# Altium schematic sheet 2V5_DIST.SchDoc: 2.5V distribution
size Letter; Organization: University of California; Address1: 475 Portola Plaza; Address2: Los Angeles, CA 90095; Revision: R01; SheetNumber: 1; SheetTotal: 1
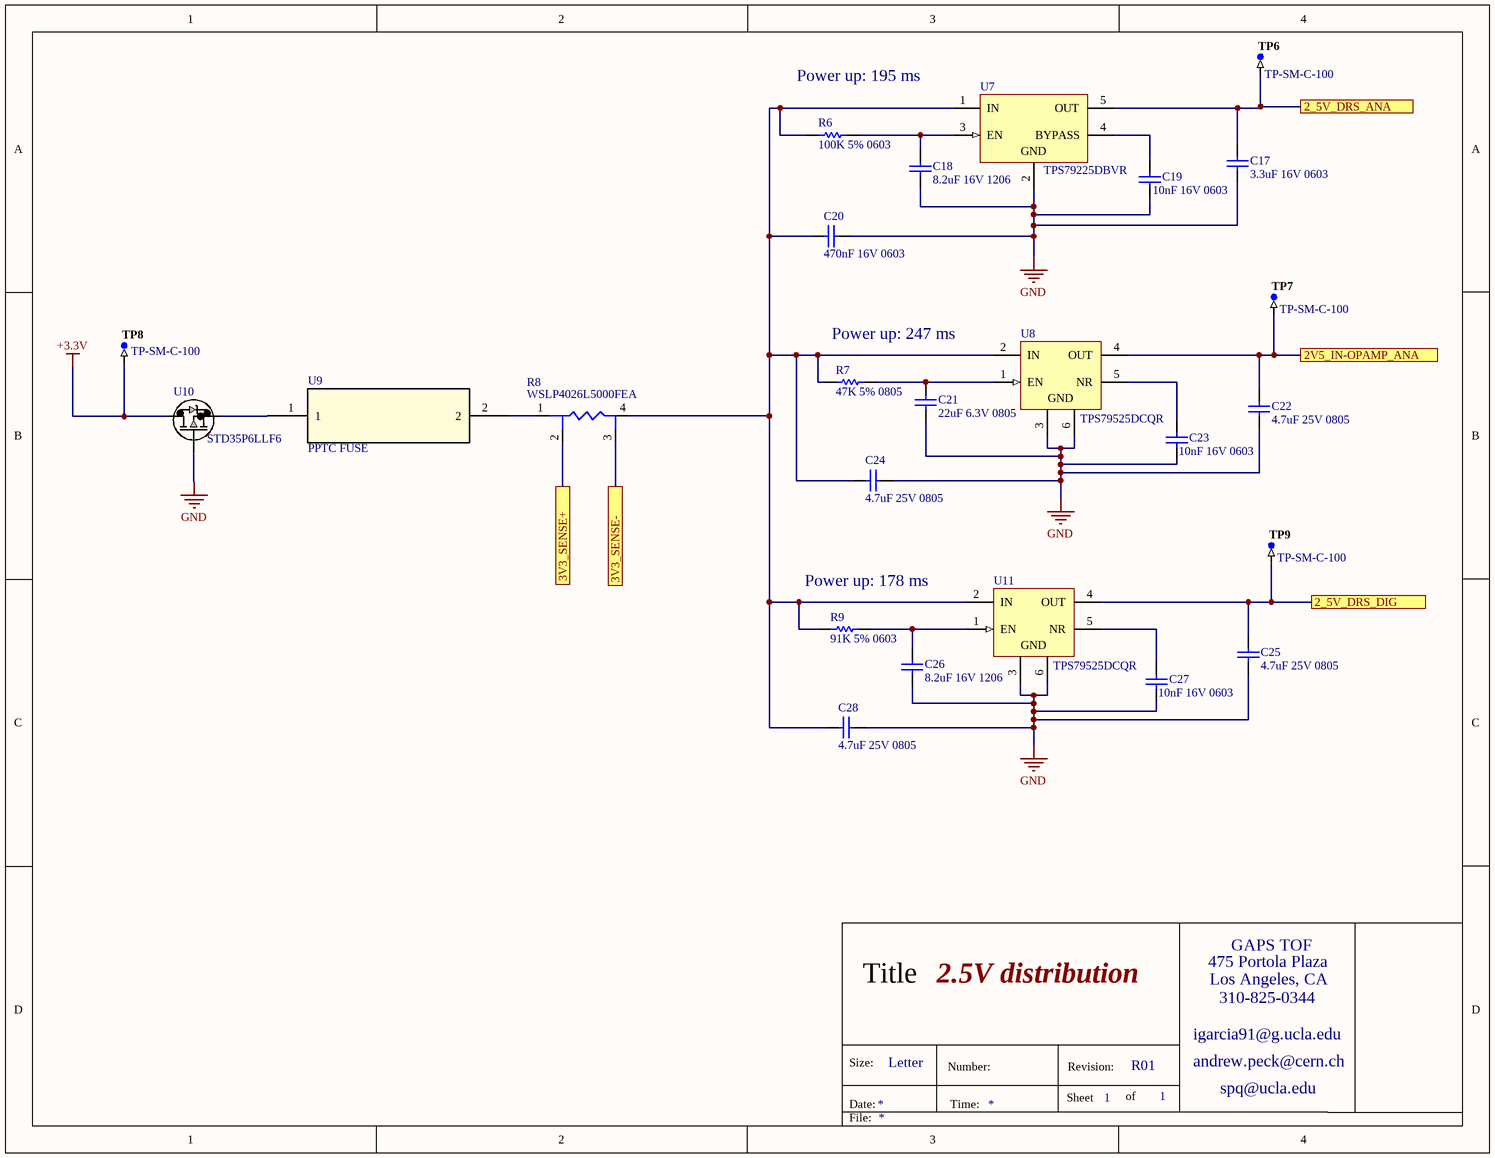
[diagram p0: 2V5_DIST.SchDoc]

## Parts
C17  3.3uF 16V 0603  [CAPC0603(1608)100_L]
C18  8.2uF 16V 1206  [CAPC1206(3216)190_N]
C19  10nF 16V 0603  [CAPC0603(1608)100_L]
C20  470nF 16V 0603  [CAPC0603(1608)100_M]
C21  22uF 6.3V 0805  [CAPC0805(2012)145_M]
C22  4.7uF 25V 0805  [CAPC0805(2012)145_L]
C23  10nF 16V 0603  [CAPC0603(1608)100_L]
C24  4.7uF 25V 0805  [CAPC0805(2012)145_L]
C25  4.7uF 25V 0805  [CAPC0805(2012)145_L]
C26  8.2uF 16V 1206  [CAPC1206(3216)190_N]
C27  10nF 16V 0603  [CAPC0603(1608)100_L]
C28  4.7uF 25V 0805  [CAPC0805(2012)145_L]
R6  100K 5% 0603  [RESC0603(1608)_N]
R7  47K 5% 0805  [RESC0805(2012)_L]
R8  WSLP4026L5000FEA
R9  91K 5% 0603  [RESC0603(1608)_L]
TP6  TP-SM-C-100  [TP-SM-C-100]  (no BOM)
TP7  TP-SM-C-100  [TP-SM-C-100]  (no BOM)
TP8  TP-SM-C-100  [TP-SM-C-100]  (no BOM)
TP9  TP-SM-C-100  [TP-SM-C-100]  (no BOM)
U7  TPS79225DBVR  [DBV0005A_M]
U8  TPS79525DCQR  [DCQ0006A_L]
U9  PPTC FUSE  [0ZCF]
U10  STD35P6LLF6  [DPAK]
U11  TPS79525DCQR  [DCQ0006A_L]

## Ports
2_5V_DRS_ANA, 2_5V_DRS_DIG, 2V5_IN-OPAMP_ANA, 3V3_SENSE+, 3V3_SENSE-

## Nets
+3.3V: TP8.1 U10.2(D)
GND: C17.1 C18.1 C19.1 C20.1 C21.1 C22.1 C23.1 C24.2 C25.1 C26.1 C27.1 C28.2 U7.2(GND) U8.3(GND) U8.6(GND) U10.1(G) U11.3(GND) U11.6(GND)
2_5V_DRS_ANA: C17.2 TP6.1 U7.5(OUT) ; port 2_5V_DRS_ANA
2_5V_DRS_DIG: C25.2 TP9.1 U11.4(OUT) ; port 2_5V_DRS_DIG
2V5_IN-OPAMP_ANA: C22.2 TP7.1 U8.4(OUT) ; port 2V5_IN-OPAMP_ANA
3V3_SENSE+: R8.2 ; port 3V3_SENSE+
3V3_SENSE-: R8.3 ; port 3V3_SENSE-
NetC18_2: C18.2 R6.2 U7.3(EN)
NetC19_2: C19.2 U7.4(BYPASS)
NetC20_2: C20.2 C24.1 C28.1 R6.1 R7.1 R8.4 R9.1 U7.1(IN) U8.2(IN) U11.2(IN)
NetC21_2: C21.2 R7.2 U8.1(EN)
NetC23_2: C23.2 U8.5(NR)
NetC26_2: C26.2 R9.2 U11.1(EN)
NetC27_2: C27.2 U11.5(NR)
NetR8_1: R8.1 U9.2
NetU9_1: U9.1 U10.3(S)

## Notes on the sheet
- Power up: 195 ms
- Power up: 247 ms
- Power up: 178 ms
- 475 Portola Plaza
- GAPS TOF
- Title
- igarcia91@g.ucla.edu
- Los Angeles, CA
- 310-825-0344
- Size:
- Date:
- Letter
- Number:
- Time:
- Sheet
- Revision:
- of
- andrew.peck@cern.ch
- spq@ucla.edu
- File:

## Library data of the parts
C17 = CMP-1035-02774-1: CAP 3.3uF 16V ±20% 0603 (1608 Metric) Thickness 1mm SMD; Case-Metric: 1608; Tolerance: Â±20%; Case-EIA: 0603; Technology: SMT; Rated Voltage: 16 V; Max Thickness: 1 mm; Value: 3.3uF
C18 C26 = CMP-1037-04959-1: CAP 8.2uF 16V ±20% 1206 (3216 Metric) Thickness 1.9mm SMD; Case-EIA: 1206; Case-Metric: 3216; Tolerance: Â±20%; Technology: SMT; Max Thickness: 1.9 mm; Value: 8.2uF; Rated Voltage: 16 V
C19 C23 C27 = CMP-1035-02311-1: CAP 10nF 16V ±10% 0603 (1608 Metric) Thickness 1mm SMD; Case-EIA: 0603; Case-Metric: 1608; Tolerance: Â±10%; Rated Voltage: 16 V; Value: 10nF; Max Thickness: 1 mm; Technology: SMT
C20 = CMP-1035-02700-1: CAP 470nF 16V ±10% 0603 (1608 Metric) Thickness 1mm SMD; Tolerance: Â±10%; Case-EIA: 0603; Case-Metric: 1608; Technology: SMT; Max Thickness: 1 mm; Value: 470nF; Rated Voltage: 16 V
C21 = CMP-1036-04939-1: CAP 22uF 6.3V ±20% 0805 (2012 Metric) Thickness 1.45mm SMD; Case-EIA: 0805; Tolerance: Â±20%; Case-Metric: 2012; Max Thickness: 1.45 mm; Technology: SMT; Rated Voltage: 6.3 V; Value: 22uF
C22 C24 C25 C28 = CMP-1036-04895-1: CAP 4.7uF 25V ±10% 0805 (2012 Metric) Thickness 1.45mm SMD; Case-Metric: 2012; Case-EIA: 0805; Tolerance: Â±10%; Value: 4.7uF; Technology: SMT; Rated Voltage: 25 V; Max Thickness: 1.45 mm
R6 = CMP-1012-00122-1: 100K 0.1W 5% 0603 (1608 Metric)  SMD; Case-EIA: 0603; Value: 100000.00 Ohm; Case-Metric: 1608; Tolerance: 5 %; Power: 0.1 W; Technology: SMT
R7 = CMP-1013-00114-1: 47K 0.125W 5% 0805 (2012 Metric)  SMD; Case-Metric: 2012; Case-EIA: 0805; Value: 47000.00 Ohm; Tolerance: 5 %; Power: 0.125 W; Technology: SMT
R8 = WSLP4026L5000FEA: Current Sense Resistors - SMD 7watt .0005ohm 1%
R9 = CMP-1012-00121-1: 91K 0.1W 5% 0603 (1608 Metric)  SMD; Value: 91000.00 Ohm; Case-Metric: 1608; Case-EIA: 0603; Tolerance: 5 %; Power: 0.1 W; Technology: SMT
TP6-TP9 = CMP-0484-00002-2: Test Point, Surface Mount, Circular, Pad Diameter 1 mm; Manufacturer: No Vendor; PartNumber: TP-SM-C-100
U7 = CMP-0394-00239-2: Single Output High PSRR LDO, 100 mA, Fixed 2.5 V Output, 2.7 to 5.5 V Input, 5-pin SOT-23 (DBV), -40 to 125 degC, Green (RoHS & no Sb/Br); Manufacturer: Texas Instruments; Vdo(Typ)(mV): 55; Vin(Max)(V): 5.5; Vout Adj(Max)(V): 2.5; Vin(Min)(V): 2.7; Accuracy(%): 2; Iout(Max)(A): 0.1; SubFamily: Single Channel LDO; Iq(Typ)(mA): 0.2; Rating: Catalog; ComponentLink4Description: URL Link1; ComponentLink3Description: Package Specification; Mounting Technology: Surface Mount; ComponentLink2URL: http://www.ti.com/general/docs/lit/getliterature.tsp?genericPartNumber=TPS79225&fileType=pdf; ComponentLink1URL: http://www.ti.com/; PackageReference: DBV0005A; ComponentLink3URL: http://www.ti.com/litv/pdf/mpds018i; ComponentLink2Description: Datasheet; Fixed Output Options(V): 2.5; Vout Adj(Min)(V): 2.5; PackageVersion: 4073253-4/K; PartNumber: TPS79225DBVR; Eco-Plan: Green (RoHS & no Sb/Br); DatasheetVersion: SLVS337B; Code_JEDEC: MO-178; ComponentLink4URL: Samples URL:http://www.ti.com/product/tps79225#samples; PackageDescription: 5-Pin Plastic Small Outline, Body 1.60 Ãƒâ€” 2.90 mm, Pitch 0.95 mm; ComponentLink1Description: Manufacturer URL
U8 U11 = CMP-0395-00444-2: Single Output High PSRR LDO, 500 mA, Fixed 2.5 V Output, 2.7 to 5.5 V Input, 6-pin SOT-223 (DCQ), -40 to 125 degC, Green (RoHS & no Sb/Br); Manufacturer: Texas Instruments; Iout(Max)(A): 0.5; Vout Adj(Min)(V): 2.5; Vin(Max)(V): 5.5; SubFamily: Single Channel LDO; Vdo(Typ)(mV): 110; Rating: Catalog; Accuracy(%): 2; Iq(Typ)(mA): 0.26; Vin(Min)(V): 2.7; ComponentLink3URL: http://www.ti.com/litv/pdf/mpds098c; ComponentLink1URL: http://www.ti.com/; Eco-Plan: Green (RoHS & no Sb/Br); PackageDescription: 6-Pin Plastic Small Outline, Body 3.5 x 6.5 mm, Pitch 1.27 mm; PartNumber: TPS79525DCQR; Fixed Output Options(V): 2.5; ComponentLink1Description: Manufacturer URL; PackageReference: DCQ0006A; ComponentLink2Description: Datasheet; Vout Adj(Max)(V): 2.5; ComponentLink3Description: Package Specification; ComponentLink2URL: http://www.ti.com/general/docs/lit/getliterature.tsp?genericPartNumber=TPS79525&fileType=pdf; Mounting Technology: Surface Mount; DatasheetVersion: SLVS350H; PackageVersion: 4202109/D
U9 = 0ZCF0250FF2C: Resettable Fuses - PPTC; Vendor: Belfuse; Built_By: EMA_UL_Team; C: Copyright (C) 2016 Accelerated Designs. All rights reserved; Manufacturer_Part_Number: 0ZCF0250FF2C; RefDes: RefDes; Type: DEV; Value: Value
U10 = STD35P6LLF6: MOSFET P-channel 60 V, 0.025 Ohm typ., 35 A STripFET F6 Power MOSFET in a DPAK package; Manufacturer_Part_Number: STD35NF06T4; Vendor: STMicroelectronics; Built_By: EMA_UL_Team; C: Copyright (C) 2015 Accelerated Designs. All rights reserved; RefDes: RefDes; Type: DEV; Value: Value